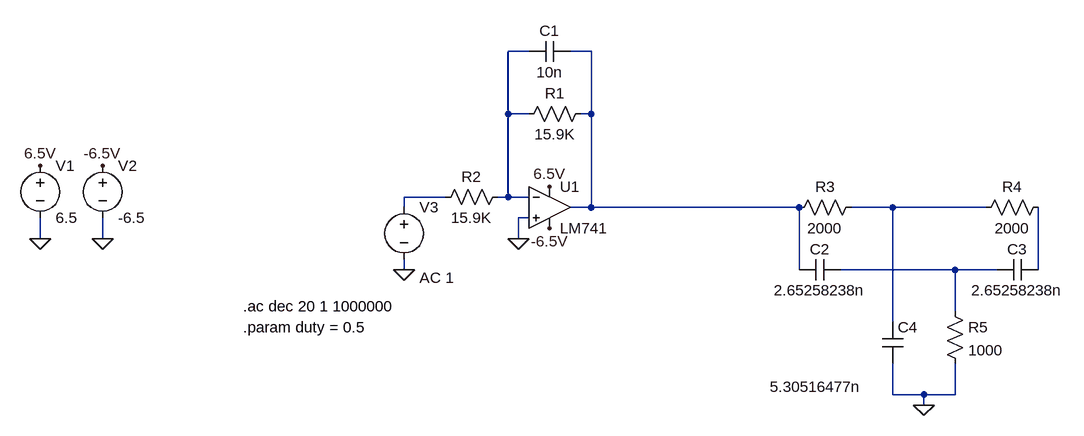
[diagram p0: schematic twin_t_test.asc]
twin_t_test.asc, the LTspice schematic file:
Version 4
SHEET 1 992 680
WIRE 160 -80 128 -80
WIRE 256 -80 224 -80
WIRE 128 16 128 -80
WIRE 160 16 128 16
WIRE 256 16 256 -80
WIRE 256 16 240 16
WIRE 32 144 -32 144
WIRE 128 144 128 16
WIRE 128 144 112 144
WIRE 160 144 128 144
WIRE -32 160 -32 144
WIRE 256 160 256 16
WIRE 256 160 224 160
WIRE 576 160 256 160
WIRE 720 160 656 160
WIRE 864 160 720 160
WIRE 160 176 144 176
WIRE -592 208 -592 176
WIRE -496 208 -496 176
WIRE 144 208 144 176
WIRE -32 256 -32 240
WIRE 576 256 576 160
WIRE 816 256 640 256
WIRE 880 256 816 256
WIRE 944 256 944 160
WIRE 816 320 816 256
WIRE 720 336 720 160
WIRE 720 448 720 400
WIRE 768 448 720 448
WIRE 816 448 816 400
WIRE 816 448 768 448
WIRE 768 464 768 448
FLAG -592 208 0
FLAG -496 208 0
FLAG -592 96 6.5V
FLAG 192 128 6.5V
FLAG -496 96 -6.5V
FLAG 192 192 -6.5V
FLAG 144 208 0
FLAG -32 256 0
FLAG 768 464 0
SYMBOL ZZZ\\OpAmp\\LM741 192 96 R0
SYMATTR InstName U1
SYMBOL voltage -592 80 R0
WINDOW 123 0 0 Left 0
WINDOW 39 0 0 Left 0
SYMATTR InstName V1
SYMATTR Value 6.5
SYMBOL voltage -496 80 R0
WINDOW 123 0 0 Left 0
WINDOW 39 0 0 Left 0
SYMATTR InstName V2
SYMATTR Value -6.5
SYMBOL res 256 0 R90
WINDOW 0 0 56 VBottom 2
WINDOW 3 32 56 VTop 2
SYMATTR InstName R1
SYMATTR Value 15.9K
SYMBOL cap 224 -96 R90
WINDOW 0 0 32 VBottom 2
WINDOW 3 32 32 VTop 2
SYMATTR InstName C1
SYMATTR Value 10n
SYMBOL voltage -32 144 R0
WINDOW 3 -575 233 Left 2
WINDOW 123 24 124 Left 2
WINDOW 39 0 0 Left 0
SYMATTR Value ""
SYMATTR Value2 AC 1
SYMATTR InstName V3
SYMBOL res 128 128 R90
WINDOW 0 0 56 VBottom 2
WINDOW 3 32 56 VTop 2
SYMATTR InstName R2
SYMATTR Value 15.9K
SYMBOL res 672 144 R90
WINDOW 0 0 56 VBottom 2
WINDOW 3 32 56 VTop 2
SYMATTR InstName R3
SYMATTR Value 2000
SYMBOL res 960 144 R90
WINDOW 0 0 56 VBottom 2
WINDOW 3 32 56 VTop 2
SYMATTR InstName R4
SYMATTR Value 2000
SYMBOL cap 640 240 R90
WINDOW 0 0 32 VBottom 2
WINDOW 3 32 32 VTop 2
SYMATTR InstName C2
SYMATTR Value 2.65258238n
SYMBOL cap 944 240 R90
WINDOW 0 0 32 VBottom 2
WINDOW 3 32 32 VTop 2
SYMATTR InstName C3
SYMATTR Value 2.65258238n
SYMBOL res 800 304 R0
SYMATTR InstName R5
SYMATTR Value 1000
SYMBOL cap 704 336 R0
WINDOW 3 -173 100 Left 2
SYMATTR InstName C4
SYMATTR Value 5.30516477n
TEXT -280 312 Left 2 !.ac dec 20 1 1000000
TEXT -280 344 Left 2 !.param duty = 0.5

The netlist it stands for:
* twin_t_test.asc
XU1 0 N001 6.5V -6.5V N002 LM741  ; pins In+ In- V+ V- OUT
V1 6.5V 0 6.5
V2 -6.5V 0 -6.5
R1 N002 N001 15.9K
C1 N002 N001 10n
V3 N003 0 AC 1
R2 N001 N003 15.9K
R3 N004 N002 2000
R4 N006 N004 2000
C2 N005 N002 2.65258238n
C3 N006 N005 2.65258238n
R5 N005 0 1000
C4 N004 0 5.30516477n
.ac dec 20 1 1000000
.param duty = 0.5
.lib LM741.lib
.backanno
.end